# EasyEDA Pro project 射频采集模块.eprj

# Schematic 射频采集模块
Create Date: 2024-12-20; Page Name: P1_1; Project Name: 射频放大比较模块; Schematic Name: 射频放大比较模块; Update Date: 2024-12-20
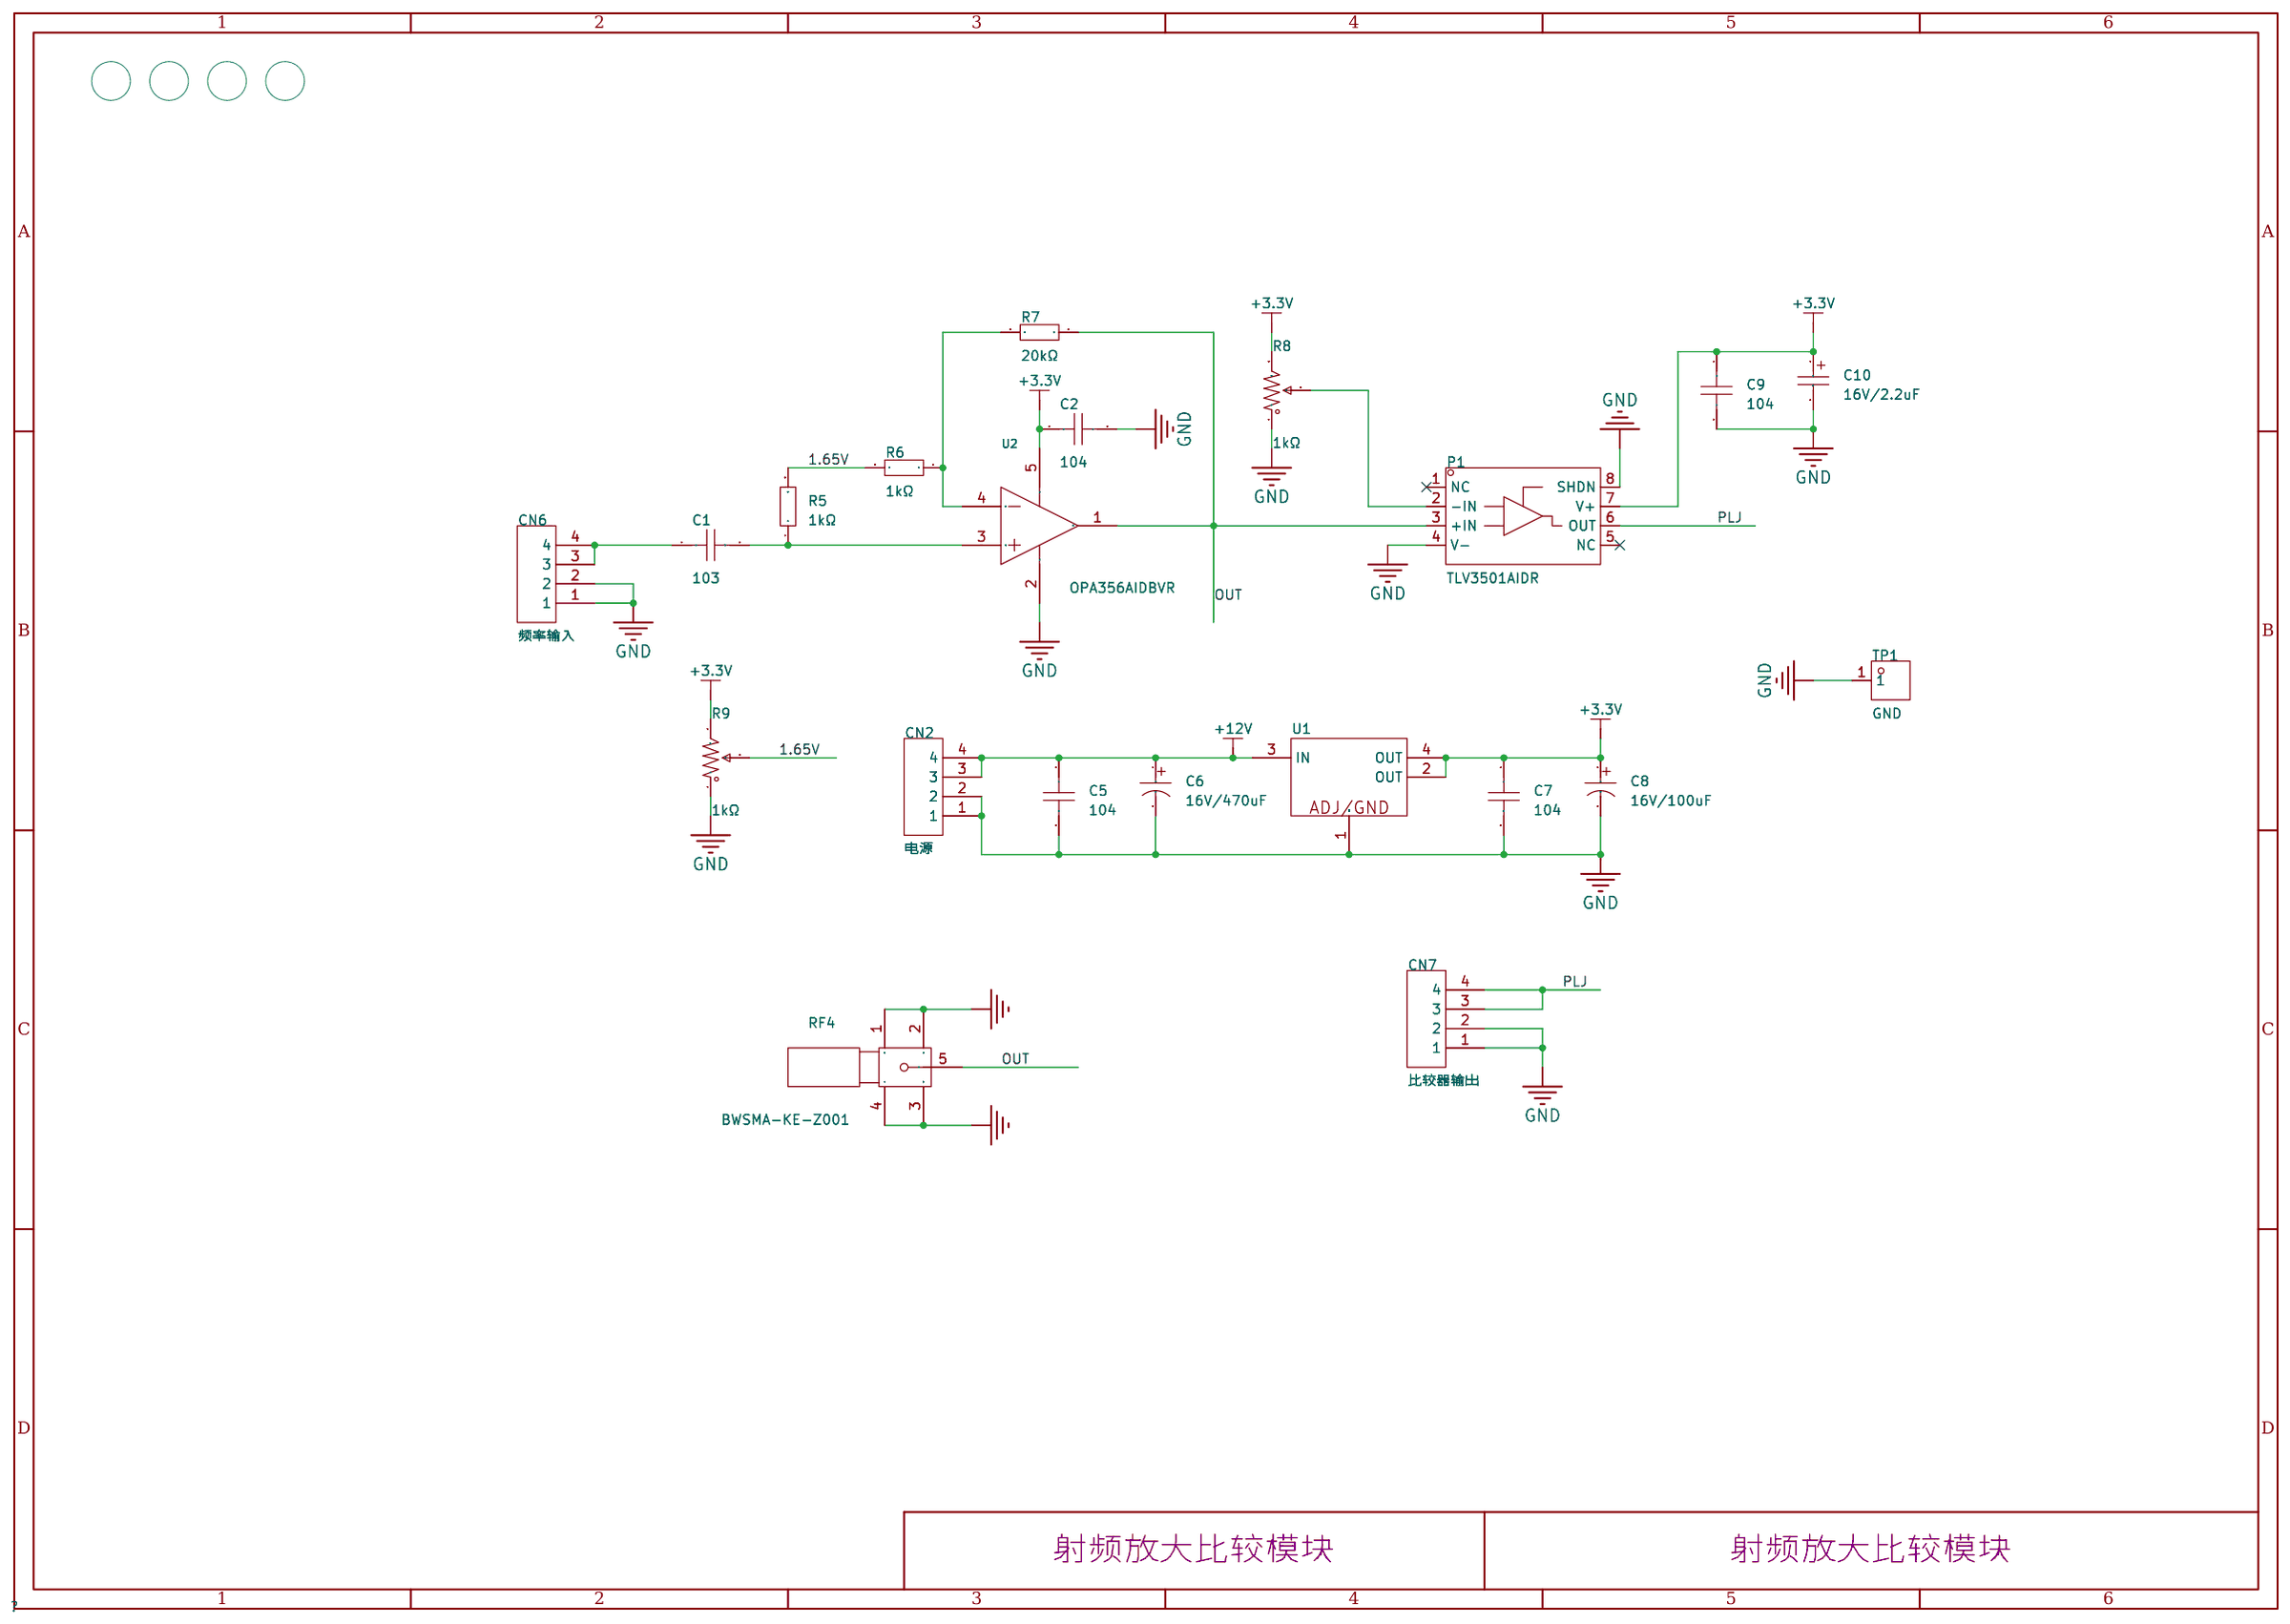
[diagram p0: schematic sheet]

## Parts
A1  -  [POST_4mm]  (no BOM)
A2  -  [POST_4mm]  (no BOM)
A3  -  [POST_4mm]  (no BOM)
A4  -  [POST_4mm]  (no BOM)
C1  103  [CAP-TH_L7.2-W4.0-P5.00-D0.5]
C2  104  [CAP-TH_L7.2-W4.0-P5.00-D0.5]
C5  104  [CAP-TH_L7.2-W4.0-P5.00-D0.5]
C6  16V/470uF  [CAP-TH_BD8.0-P3.50-D0.6-FD]
C7  104  [CAP-TH_L7.2-W4.0-P5.00-D0.5]
C8  16V/100uF  [CAP-TH_BD6.3-P2.50-D1.0-FD]
C9  104  [CAP-TH_L7.2-W4.0-P5.00-D0.5]
C10  16V/2.2uF  [CASE-A_3216]
CN2  电源  [CONN-TH_4P-P2.54_A2510S-4P]
CN6  频率输入  [CONN-TH_4P-P2.54_A2510S-4P]
CN7  比较器输出  [CONN-TH_4P-P2.54_A2510S-4P]
P1  TLV3501AIDR  [SOP-8_L4.9-W3.9-P1.27-LS6.0-BL]
R5  1kΩ  [RES-TH_BD2.5-L6.5-P10.50-D0.6]
R6  1kΩ  [RES-TH_BD2.5-L6.5-P10.50-D0.6]
R7  20kΩ  [RES-TH_BD2.5-L6.5-P10.50-D0.6]
R8  1kΩ  [RES-ADJ-TH_3296P]
R9  1kΩ  [RES-ADJ-TH_3296P]
RF4  BWSMA-KE-Z001  [SMA-TH_BWSMA-KE-Z001]
TP1  GND  [TESTPOINT-TH_BD3.2]
U1  AMS1117-3.3  [SOT-223-3_L6.4-W3.5-P2.30-LS7.0-BR]
U2  OPA356AIDBVR  [SOT-23-5_L3.0-W1.7-P0.95-LS2.8-BR]

## Library data of the parts
A1-A4 = 安装孔
C1 C2 C5 C7 C9 = 104电容: 容值:100nF;精度:±5%;额定电压:100V;工作温度:-40~+105;; LCSC Part Name: 100nF ±5% 100V; Supplier Part: C333827; Manufacturer: HEL鸿志; Manufacturer Part: MES104J2A-7-50R0; Supplier Footprint: 径向引线,P=5mm; JLCPCB Part Class: 扩展库; Datasheet: https://atta.szlcsc.com/upload/public/pdf/source/20190802/C333827_0C3A382E0AFB64319515A56455BE3B3E.pdf; Supplier: LCSC; Tolerance: ±5%; Voltage Rated: 100V; Operating Temperature: -40~+105
C6 = 16V/470uF: 脚间距:3.5mm;电容体直径:8mm;精度:±20%;工作温度:-;额定电压:16V;容值:470uF;工作寿命:2000hrs 105℃;电容体长度:12mm;; Rated Voltage: 16V; Supplier: LCSC; Supplier Part: C28067; Supplier Footprint: 径向引线,8x12mm; JLCPCB Part Class: 扩展库; LCSC Part Name: 470uF 16V; Tolerance: ±20%; Datasheet: https://atta.szlcsc.com/upload/public/pdf/source/20151029/1457707512884.pdf; Manufacturer: CX(承兴); Manufacturer Part: KM477M016F12RR0VH2FP0; L: 12mm; Lead Spacing: 3.5mm; Lifetime @ Temp: 2000hrs 105℃; φD: 8mm
C8 = 16V/100uF: 纹波电流:95mA 120Hz;电容体直径:6.3mm;电容体长度:7mm;工作寿命:5000hrs 105℃;等效串联电阻:-;精度:±20%;工作温度:-;额定电压:16V;容值:100uF;脚间距:2.5mm;; Rated Voltage: 16V; Supplier: LCSC; Supplier Part: C88806; Supplier Footprint: 径向引线,6.3x7mm; JLCPCB Part Class: 扩展库; LCSC Part Name: 100uF 16V; Tolerance: ±20%; Datasheet: https://atta.szlcsc.com/upload/public/pdf/source/20161125/1480067897511.pdf; Manufacturer: rubycon(红宝石); Manufacturer Part: 16ML100MEFC6.3X7; L: 7mm; Lead Spacing: 2.5mm; Lifetime @ Temp: 5000hrs 105℃; Ripple Current: 95mA 120Hz; φD: 6.3mm
C10 = TAJA225K016RNJ: 容值:2.2uF;精度:±10%;额定电压:16V;等效串联电阻:6.5Ω@100kHz;; LCSC Part Name: 2.2uF ±10% 16V; Supplier Part: C7180; Manufacturer: Kyocera AVX; Supplier Footprint: CASE-A-3216; JLCPCB Part Class: Extended Part; Datasheet: https://atta.szlcsc.com/upload/public/pdf/source/20160107/1457707748378.pdf; Supplier: LCSC; Tolerance: ±10%; Rated Voltage: 16V; Equivalent Series Resistance(ESR): 6.5Ω@100kHz; Operating Temperature: -55℃~+125℃
CN2 CN6 CN7 = 2.54mm4芯插座: 参考系列:-;间距:2.54mm;插针结构:1x4P;排数:1;每排PIN数:4;行距:-;安装方式:-;触头材质:黄铜;; LCSC Part Name: MX2.54 2510系列 插座 1*4P 2.54mm 直针米黄; Supplier Part: C140769; Manufacturer: Ckmtw(灿科盟); Manufacturer Part: W-2510S04P-0000; Supplier Footprint: 插件,P=2.54mm; JLCPCB Part Class: 扩展库; Datasheet: https://atta.szlcsc.com/upload/public/pdf/source/20180423/C140769_E5973268EE8E03CF1A982B681C4FAED0.pdf; Supplier: LCSC; Pitch: 2.54mm; Pins Structure: 1x4P; Number of Rows: 1; Number of PINs Per Row: 4; Contact Material: 黄铜
P1 = TLV3501AIDR: 比较器组数:1;电源电压:2.7V ~ 5.5V, ±1.35V ~ 2.75V;各通道供电电流:5mA;输出类型:CMOS, Push-Pull, Rail-to-Rail, TTL;传播延迟:10ns;; Supplier Part: C43484; Manufacturer: TI(德州仪器); Supplier Footprint: SOP-8_150mil; JLCPCB Part Class: 扩展库; Datasheet: https://atta.szlcsc.com/upload/public/pdf/source/20150319/1457707268212.pdf; Supplier: LCSC; Number of Elements: 1; Supply Voltage（Single）: 2.7V ~ 5.5V, ±1.35V ~ 2.75V; Iq per channel (Typ): 5mA; Output Type: CMOS, Push-Pull, Rail-to-Rail, TTL; Propagation Delay (Max): 10ns; Operating Temperature: -40°C ~ 125°C
R5-R7 = 1/4W电阻: 电阻类型:金属膜电阻;阻值:1kΩ;精度:±1%;功率:250mW;温度系数:±50ppm/℃;; LCSC Part Name: 1kΩ ±1% 250mW; Supplier Part: C57435; Manufacturer: UNI-ROYAL(厚声); Manufacturer Part: MFR0W4F1001A50; Supplier Footprint: 轴向引线; JLCPCB Part Class: Extended Part; Datasheet: https://atta.szlcsc.com/upload/public/pdf/source/20170615/1497511028539.pdf; Supplier: LCSC; Type: 金属膜电阻; Tolerance: ±1%; Power(Watts): 250mW; Temperature Coefficient: ±50ppm/℃
R8 R9 = 3296P-1-102LF: 阻值:1kΩ;精度:±10%;功率:500mW;温度系数:-;; LCSC Part Name: 1kΩ ±10%; Supplier Part: C780113; Manufacturer: BOURNS; Supplier Footprint: 插件-3P,9.5x4.8mm; JLCPCB Part Class: 扩展库; Datasheet: https://atta.szlcsc.com/upload/public/pdf/source/20200907/C780107_B10DBBD0C4B43BFA1FDAF98D4F88F255.pdf; Supplier: LCSC; Tolerance: ±10%; Power(Watts): 500mW; Turns: 25
RF4 = BWSMA-KE-Z001_C496549: 连接器类型:板端;接口类型:内孔;端口数量:1;接口直径:-;接口长度/高度:-;频率-最大值:-;射频系列:SMA;阻抗:50Ω;样式:正脚;触头材质:-;触头镀层:-;工作温度范围:-65℃~+165℃;焊接温度(最大值):-;; LCSC Part Name: 内孔 SMA 正脚; Supplier Part: C496549; Manufacturer: BAT WIRELESS(蝙蝠无线); Supplier Footprint: 插件; Datasheet: https://atta.szlcsc.com/upload/public/pdf/source/20221228/40BF41E56A06003A0210E1785CA66EA6.pdf; Supplier: LCSC; Connector Type: 板端; Interface Type: 内孔; Number of Ports: 1; RF Series: SMA; Impedance: 50Ω; Style: 正脚; Operating Temperature Range: -65℃~+165℃
TP1 = 测试点: LCSC Part Name: TP-黄色测试点; Supplier Part: C9900007422; Manufacturer Part: TP-黄色测试点; Supplier Footprint: TESTPOINT-TH_BD-2P-P2.00; JLCPCB Part Class: 扩展库; Datasheet: https://atta.szlcsc.comnull; Supplier: LCSC
U1 = AMS1117-3.3: Supplier Part: C2992570; Manufacturer: 国芯佳品; Supplier Footprint: SOT-223; JLCPCB Part Class: Extended Part; Datasheet: https://atta.szlcsc.com/upload/public/pdf/source/20220729/0D21C21EC310E4778671BF6BAE438640.pdf; Supplier: LCSC
U2 = OPA356AIDBVR: 放大器组数:1;带宽(-3db):450MHz;输入偏置电流(Ib):3pA;增益带宽积(GBP):200MHz;压摆率(SR):360V/us;轨到轨:轨到轨;; Supplier Part: C183100; Manufacturer: TI(德州仪器); Supplier Footprint: SOT-23-5; JLCPCB Part Class: Extended Part; Datasheet: https://www.ti.com/cn/lit/gpn/opa356; Supplier: LCSC; Number of Circuits: 1; -3db Bandwidth: 450MHz; Current - Input Bias(Ib): 3pA; Gain Bandwidth Product(GBP): 200MHz; Slew Rate(SR): 360V/us; Rail to Rail: 轨到轨; Output Current: 100mA; Operating Temperature: -40℃~+125℃

## Nets
1.65V: R5.2 R6.2 R9.2
+3.3V: C2.1 C7.1 C8.1 C9.1 C10.1 P1.7(V+) R8.3 R9.3 U1.2(OUT) U1.4(OUT) U2.5(V+)
+12V: C5.1 C6.1 CN2.3 CN2.4 U1.3(IN)
GND: C2.2 C5.2 C6.2 C7.2 C8.2 C9.2 C10.2 CN2.1 CN2.2 CN6.1 CN6.2 CN7.1 CN7.2 P1.4(V-) P1.8(SHDN) R8.1 R9.1 RF4.1 RF4.2 RF4.3 RF4.4 TP1.1 U1.1(ADJ/GND) U2.2(V-)
OUT: P1.3(+IN) R7.1 RF4.5 U2.1(OUT)
PLJ: CN7.3 CN7.4 P1.6(OUT)
$3N10463: C1.1 CN6.3 CN6.4
$3N10636: C1.2 R5.1 U2.3(IN+)
$3N10673: R6.1 R7.2 U2.4(IN-)
Net-(P1-2): P1.2(-IN) R8.2

Not connected (* = marked no-connect by the designer): P1 1(NC)* 5(NC)*

# Board 射频采集模块
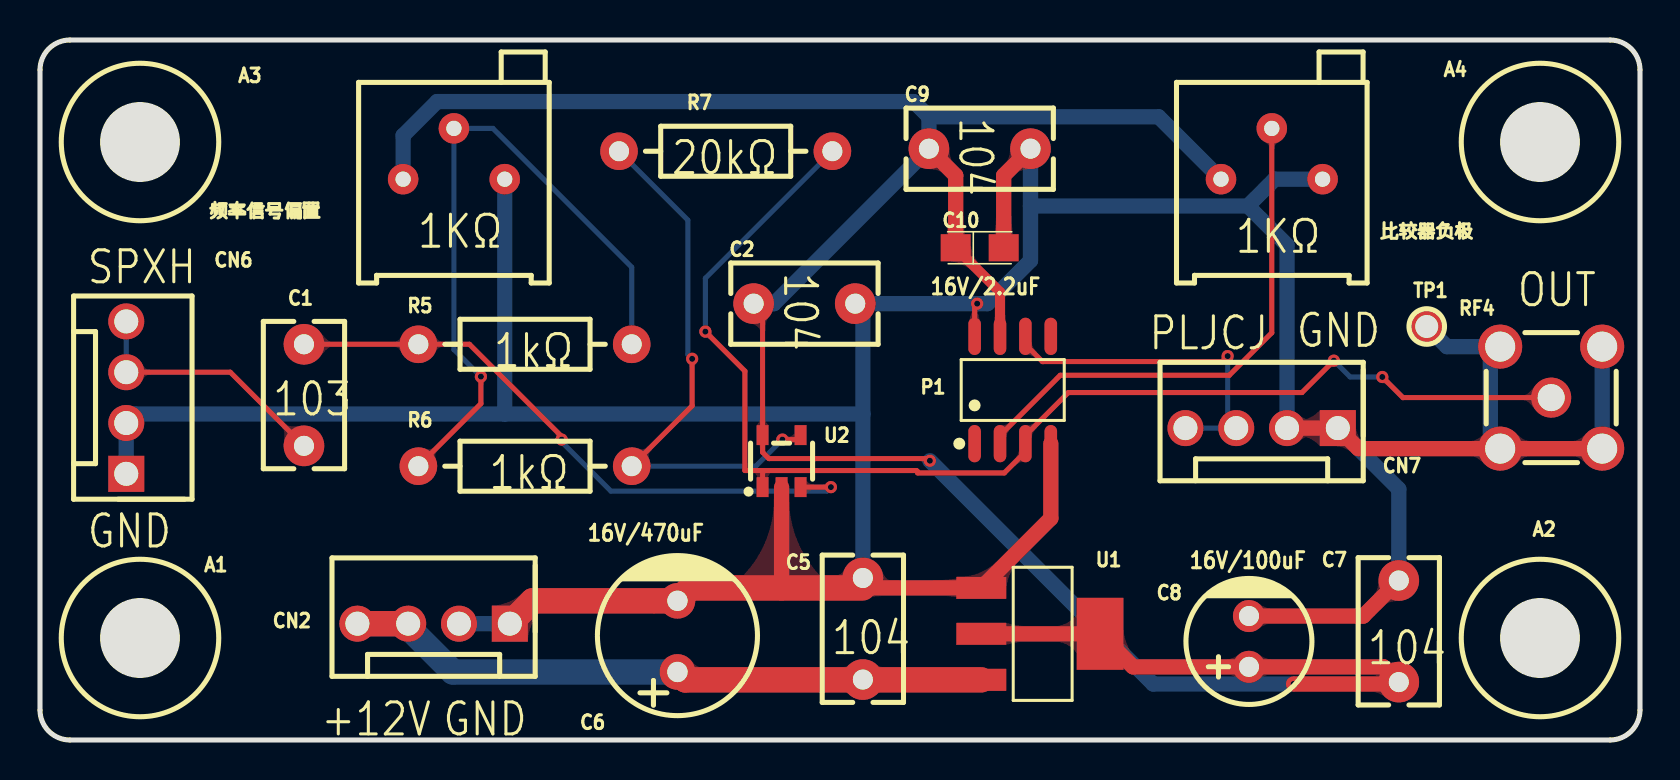
[diagram p1: board, top side]
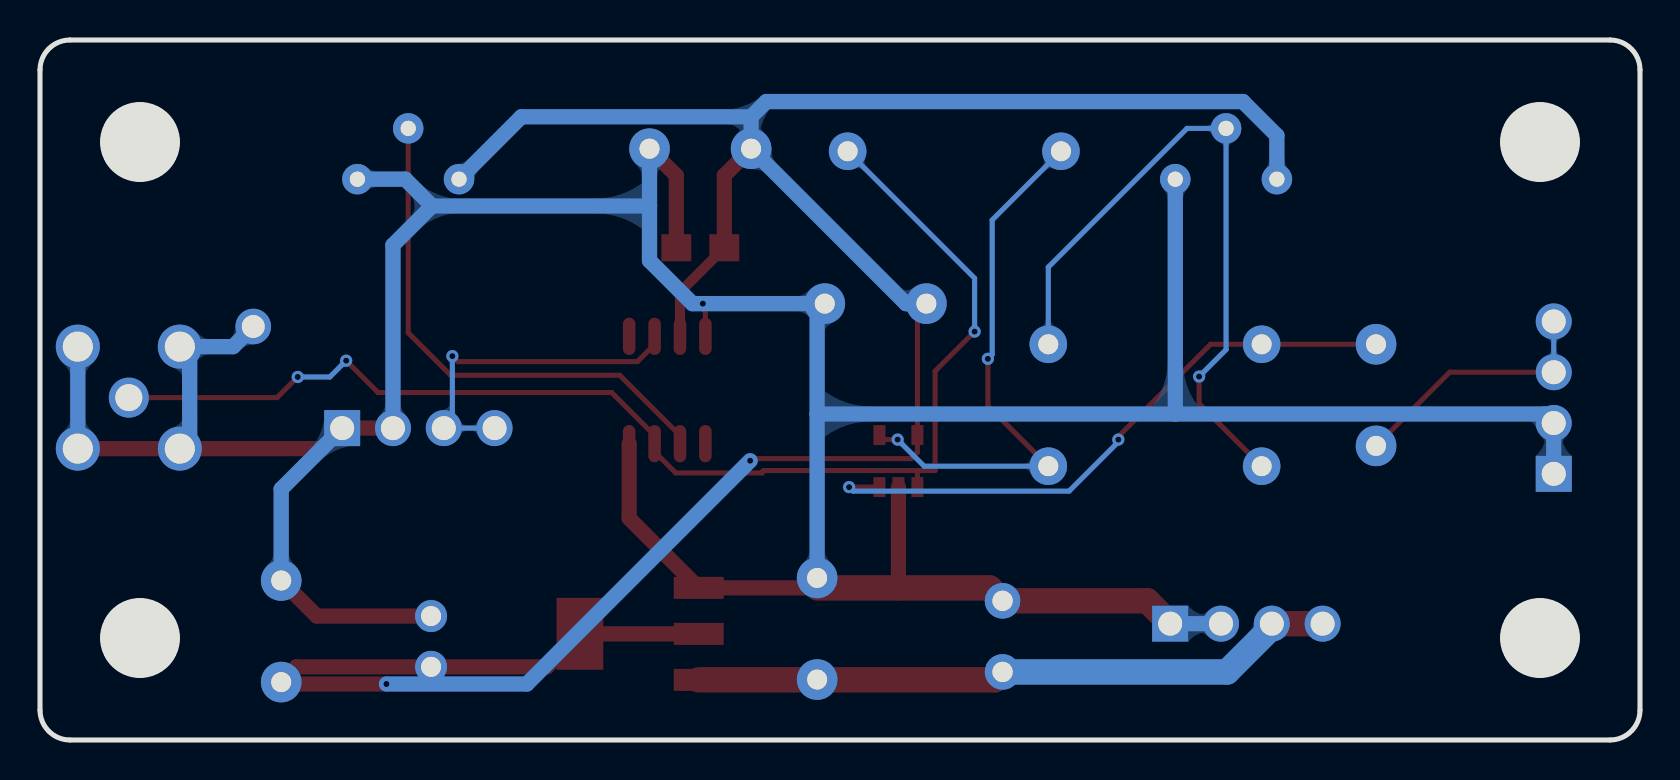
[diagram p2: board, bottom side, seen from below]

Outline 80 x 35 mm; copper layers: Top Layer, Bottom Layer. Coordinates in mm from the lower left corner of the outline.
Outline path: 0,33.5 0,1.5 arc(0.44,0.44) 1.5,0 78.5,0 arc(79.56,0.44) 80,1.5 80,33.5 arc(79.56,34.56) 78.5,35 1.5,35 arc(0.44,34.56) 0,33.5
Stack: Top Layer 0.035mm / Dielectric1 1.51mm FR4 er 4.5 / Bottom Layer 0.035mm

## Design rules (mm)
template: 自定义配置
spacing copperThickness1oz (default): track to track 0.102, other pairs 0.152 to 0.3
spacing copperThickness2oz: track to track 0.203, other pairs 0.152 to 0.3
track width copperThickness1oz (default): min 0.127, default 0.254, max 2.54
track width VCCandGND: min 0.254, default 0.762, max 2.54
track width 12V: min 0.127, default 1.27, max 2.54
differential pair differentialPair (default): width min 0.127, default 0.254, max 2.54; gap min 0.152, default 0.152
via viaSize (default): diameter min 0.5, default 0.61, max 10; hole min 0.3, default 0.305, max 6.299
net +12V uses 12V
net GND uses VCCandGND
net +3.3V uses VCCandGND

## Placement (name value [footprint] x y rotation side)
A1  -  [POST_4mm]  5 5.1 0 top
A2  -  [POST_4mm]  75 5.1 0 top
A3  -  [POST_4mm]  5 29.9 0 top
A4  -  [POST_4mm]  75 29.9 0 top
C1  103  [CAP-TH_L7.2-W4.0-P5.00-D0.5]  13.2 17.25 90 top
C2  104  [CAP-TH_L7.2-W4.0-P5.00-D0.5]  38.22 21.82 0 top
C5  104  [CAP-TH_L7.2-W4.0-P5.00-D0.5]  41.14 5.56 90 top
C6  16V/470uF  [CAP-TH_BD8.0-P3.50-D0.6-FD]  31.87 5.18 90 top
C7  104  [CAP-TH_L7.2-W4.0-P5.00-D0.5]  67.94 5.44 90 top
C8  16V/100uF  [CAP-TH_BD6.3-P2.50-D1.0-FD]  60.45 4.93 90 top
C9  104  [CAP-TH_L7.2-W4.0-P5.00-D0.5]  46.99 29.56 0 top
C10  16V/2.2uF  [CASE-A_3216]  46.99 24.61 0 top
CN2  电源  [CONN-TH_4P-P2.54_A2510S-4P]  19.68 5.82 180 top
CN6  频率输入  [CONN-TH_4P-P2.54_A2510S-4P]  4.31 17.12 90 top
CN7  比较器输出  [CONN-TH_4P-P2.54_A2510S-4P]  61.08 15.59 180 top
P1  TLV3501AIDR  [SOP-8_L4.9-W3.9-P1.27-LS6.0-BL]  48.64 17.5 0 top
R5  1kΩ  [RES-TH_BD2.5-L6.5-P10.50-D0.6]  24.25 19.79 0 top
R6  1kΩ  [RES-TH_BD2.5-L6.5-P10.50-D0.6]  24.25 13.69 180 top
R7  20kΩ  [RES-TH_BD2.5-L6.5-P10.50-D0.6]  34.28 29.44 180 top
RF4  BWSMA-KE-Z001  [SMA-TH_BWSMA-KE-Z001]  75.56 17.12 0 top
TP1  GND  [TESTPOINT-TH_BD3.2]  69.34 20.67 0 top
U1  AMS1117-3.3  [SOT-223-3_L6.4-W3.5-P2.30-LS7.0-BR]  50.03 5.31 180 top
U2  OPA356AIDBVR  [SOT-23-5_L3.0-W1.7-P0.95-LS2.8-BR]  37.08 13.94 270 top
比较器负极  1kΩ  [RES-ADJ-TH_3296P]  61.59 29.31 90 top
频率信号偏置  1kΩ  [RES-ADJ-TH_3296P]  20.7 29.31 90 top

## Footprints (pads in the part's own frame, mm; a bottom-side part is the same pattern mirrored in y, then rotated)
CAP-TH_BD6.3-P2.50-D1.0-FD
  round 1.6 hole 1: 1(-1.27,0) 2(1.27,0)
CAP-TH_BD8.0-P3.50-D0.6-FD
  round 1.778 hole 1.016: 1(-1.778,0) 2(1.778,0)
CAP-TH_L7.2-W4.0-P5.00-D0.5
  round 2.032 hole 1.001: 1(-2.54,0) 2(2.54,0)
CASE-A_3216
  rect 1.5x1.359 smd: 1(-1.2,0) 2(1.2,0)
CONN-TH_4P-P2.54_A2510S-4P
  rect 1.8x1.8 hole 1.2: 1(-3.81,0)
  round 1.8 hole 1.2: 2(-1.27,0) 3(1.27,0) 4(3.81,0)
RES-ADJ-TH_3296P
  round 1.524 hole 0.762: 1(-1.27,-2.54) 2(1.27,0) 3(-1.27,2.54)
RES-TH_BD2.5-L6.5-P10.50-D0.6
  round 1.879 hole 1: 1(-5.334,0) 2(5.334,0)
SMA-TH_BWSMA-KE-Z001
  round 2.2 hole 1.5: 1(-2.55,-2.55) 2(-2.55,2.55) 3(2.55,2.55) 4(2.55,-2.55)
  round 2 hole 1.35: 5(0,0)
SOP-8_L4.9-W3.9-P1.27-LS6.0-BL
  oval 0.63x1.865 smd: 1(-1.905,-2.683) 2(-0.635,-2.683) 3(0.635,-2.683) 4(1.905,-2.683) 5(1.905,2.683) 6(0.635,2.683) 7(-0.635,2.683) 8(-1.905,2.683)
SOT-23-5_L3.0-W1.7-P0.95-LS2.8-BR
  rect 1x0.6 smd: 1(1.3,-0.95) 2(1.3,0) 3(1.3,0.95) 4(-1.3,0.95) 5(-1.3,-0.95)
SOT-223-3_L6.4-W3.5-P2.30-LS7.0-BR
  rect 2.499x1.1 smd: 1(2.97,-2.299) 2(2.97,0) 3(2.97,2.301)
  rect 2.34x3.599 smd: 4(-2.97,0)
TESTPOINT-TH_BD3.2
  round 1.778 hole 1.143: 1(0,0)

## Nets
1.65V: R5.2 R6.2 频率信号偏置.2
+3.3V: C2.1 C7.1 C8.1 C9.1 C10.1 P1.7 U1.2 U1.4 U2.5 比较器负极.3 频率信号偏置.3
+12V: C5.1 C6.1 CN2.3 CN2.4 U1.3
GND: C2.2 C5.2 C6.2 C7.2 C8.2 C9.2 C10.2 CN2.1 CN2.2 CN6.1 CN6.2 CN7.1 CN7.2 P1.4 P1.8 RF4.1 RF4.2 RF4.3 RF4.4 TP1.1 U1.1 U2.2 比较器负极.1 频率信号偏置.1
OUT: P1.3 R7.1 RF4.5 U2.1
PLJ: CN7.3 CN7.4 P1.6
$3N10463: C1.1 CN6.3 CN6.4
$3N10636: C1.2 R5.1 U2.3
$3N10673: R6.1 R7.2 U2.4
$3N16008: P1.2 比较器负极.2

Pads without a net: P1 1 5

## Via types
v1: diameter 0.61, hole 0.305, Top Layer to Bottom Layer, 12 vias

## Routing (per net, layer and track width the routed paths; a pad name or vN(x,y) marks a point on that pad's centre or on a via; arc(x,y) is an arc through that point)
1.65V: length 34.4
  Top Layer w0.254: v1(22.04,18.17) 22.04,16.82 R6.2
  Bottom Layer w0.254: v1(22.04,18.17) 20.7,19.52 频率信号偏置.2 22.65,30.58 29.59,23.64 R5.2
+3.3V: length 136
  Top Layer w0.254: v1(44.49,13.96) 44.39,14.07 36.44,14.07 36.13,14.39 36.13,21.37 C2.1
  Top Layer w0.508: P1.7 48,22.4 45.78,24.61
  Top Layer w0.762: U1.2 U1.4 54.65,3.66 67.18,3.66 C7.1 67.85,2.8 v1(62.68,2.8) ; 44.44,29.56 45.78,28.22 45.78,24.61
  Bottom Layer w0.762: 18.16,28.04 18.16,30.22 19.85,31.92 43.68,31.92 44.44,31.16 ; 59.05,28.04 55.93,31.16 44.44,31.16 ; C2.1 36.7,21.82 44.44,29.56 44.44,31.16 ; v1(62.68,2.8) 55.66,2.8 v1(44.49,13.96)
+12V: length 32.5
  Top Layer w1.27: 31.87,3.4 32.27,3.01 41.14,3.01 ; C5.1 41.14,3.01 ; 41.14,3.01 U1.3 ; CN2.4 CN2.3
  Bottom Layer w1.27: 31.87,3.4 20.65,3.4 18.41,5.64 CN2.3
GND: length 203.4
  Top Layer w0.254: P1.8 46.73,21.69 v1(46.86,21.82)
  Top Layer w0.762: C9.2 48.19,28.22 C10.2 ; RF4.4 RF4.1 65.92,14.57 CN7.1 CN7.2 ; C7.2 66.16,6.2 C8.2 ; U2.2 37.08,7.61 ; P1.4 50.54,11.08 U1.1 41.14,7.61 C5.2
  Top Layer w1.27: 41.14,7.61 32.52,7.61 C6.2 24.63,6.96 CN2.1
  Bottom Layer w0.762: CN2.2 CN2.1 ; 23.24,16.3 4.76,16.3 CN6.2 CN6.1 ; 23.24,16.3 23.24,28.04 ; 23.24,16.3 41.14,16.3 ; C5.2 41.14,16.3 ; 41.14,16.3 41.14,21.82 ; CN7.2 62.35,24.74 60.4,26.7 ; 60.4,26.7 61.74,28.04 64.13,28.04 ; 60.4,26.7 49.53,26.7 ; 41.14,21.82 v1(46.86,21.82) 47.37,21.82 49.53,23.97 49.53,26.7 ; 41.14,21.82 C2.2 ; TP1.1 70.34,19.67 72.52,19.67 ; 49.53,26.7 C9.2 ; RF4.2 72.52,19.67 ; 72.52,19.67 72.52,15.06 RF4.1 ; RF4.3 RF4.4 ; CN7.1 67.94,12.55 C7.2
OUT: length 64.2
  Top Layer w0.254: 36.13,12.64 36.13,13.47 ; 36.13,13.47 35.25,13.47 35.25,18.44 v1(33.27,20.42) ; 36.13,13.47 43.82,13.47 43.88,13.41 43.88,13.35 48.22,13.35 49.27,14.41 P1.3 49.27,15.23 51.42,17.37 63.1,17.37 v1(64.69,18.97) ; v1(67.11,18.15) 68.15,17.12 RF4.5
  Bottom Layer w0.254: R7.1 33.27,23.09 v1(33.27,20.42) ; v1(64.69,18.97) 65.51,18.15 v1(67.11,18.15)
PLJ: length 17.1
  Top Layer w0.254: P1.6 49.27,19.77 50.12,18.92 59.11,18.92 v1(59.38,19.19)
  Bottom Layer w0.254: 59.38,15.59 CN7.4 ; 59.38,15.59 CN7.3 ; 59.38,15.59 v1(59.38,19.19)
$3N10463: length 13
  Top Layer w0.254: CN6.3 9.52,18.39 C1.1
  Bottom Layer w0.254: CN6.4 CN6.3
$3N10636: length 31.1
  Top Layer w0.254: C1.2 R5.1 21.47,19.79 26.08,15.17 v1(26.08,15.02) ; U2.3 v1(39.55,12.64)
  Bottom Layer w0.254: v1(39.55,12.64) 39.34,12.44 28.54,12.44 26.08,14.91 v1(26.08,15.02)
$3N10673: length 27.6
  Top Layer w0.254: R6.1 32.61,16.71 v1(32.61,19.06) ; v1(37.12,15.02) 37.81,15.02 U2.4
  Bottom Layer w0.254: R7.2 32.39,26 32.39,19.28 v1(32.61,19.06) ; R6.1 35.79,13.69 v1(37.12,15.02)
$3N16008: length 26.3
  Top Layer w0.254: P1.2 48,15.23 51.01,18.24 59.47,18.24 61.59,20.36 比较器负极.2

## Copper pours and planes (outline as drawn; the poured copper is in the pictures)
GND on Top Layer: -8.01,40.23 90.55,40.23 90.55,-8.03 -8.01,-8.03
GND on Bottom Layer: -8.77,41 90.04,41 90.04,-8.53 -8.77,-8.53

Small or netless copper shapes (teardrops, artwork), in the pictures only: 68 on Top Layer, 54 on Bottom Layer

## Text on the board
Top Silkscreen Layer: 16V/2.2uF | 16V/100uF | 16V/470uF | 1KΩ | 20kΩ | 1kΩ | SPXH | GND | 103 | +12V | PLJCJ | OUT | 104
